# Altium schematic sheet 2_FPGA.schdoc.schdoc
size 431 x 309 mm; Symbol: Sheet-Symbol_A4; Device: Sheet-Symbol_A4; Company: 嘉立创EDA; Version: V1.0; Page Size: A4; @Project Name: ProDocument_LN_CTRL_V1; @Page Count: 5; @Update Date: 2026-01-05; @Create Date: 2026-01-05; @Schematic Name: Schematic1; @Page No: 2; @Page Name: FPGA
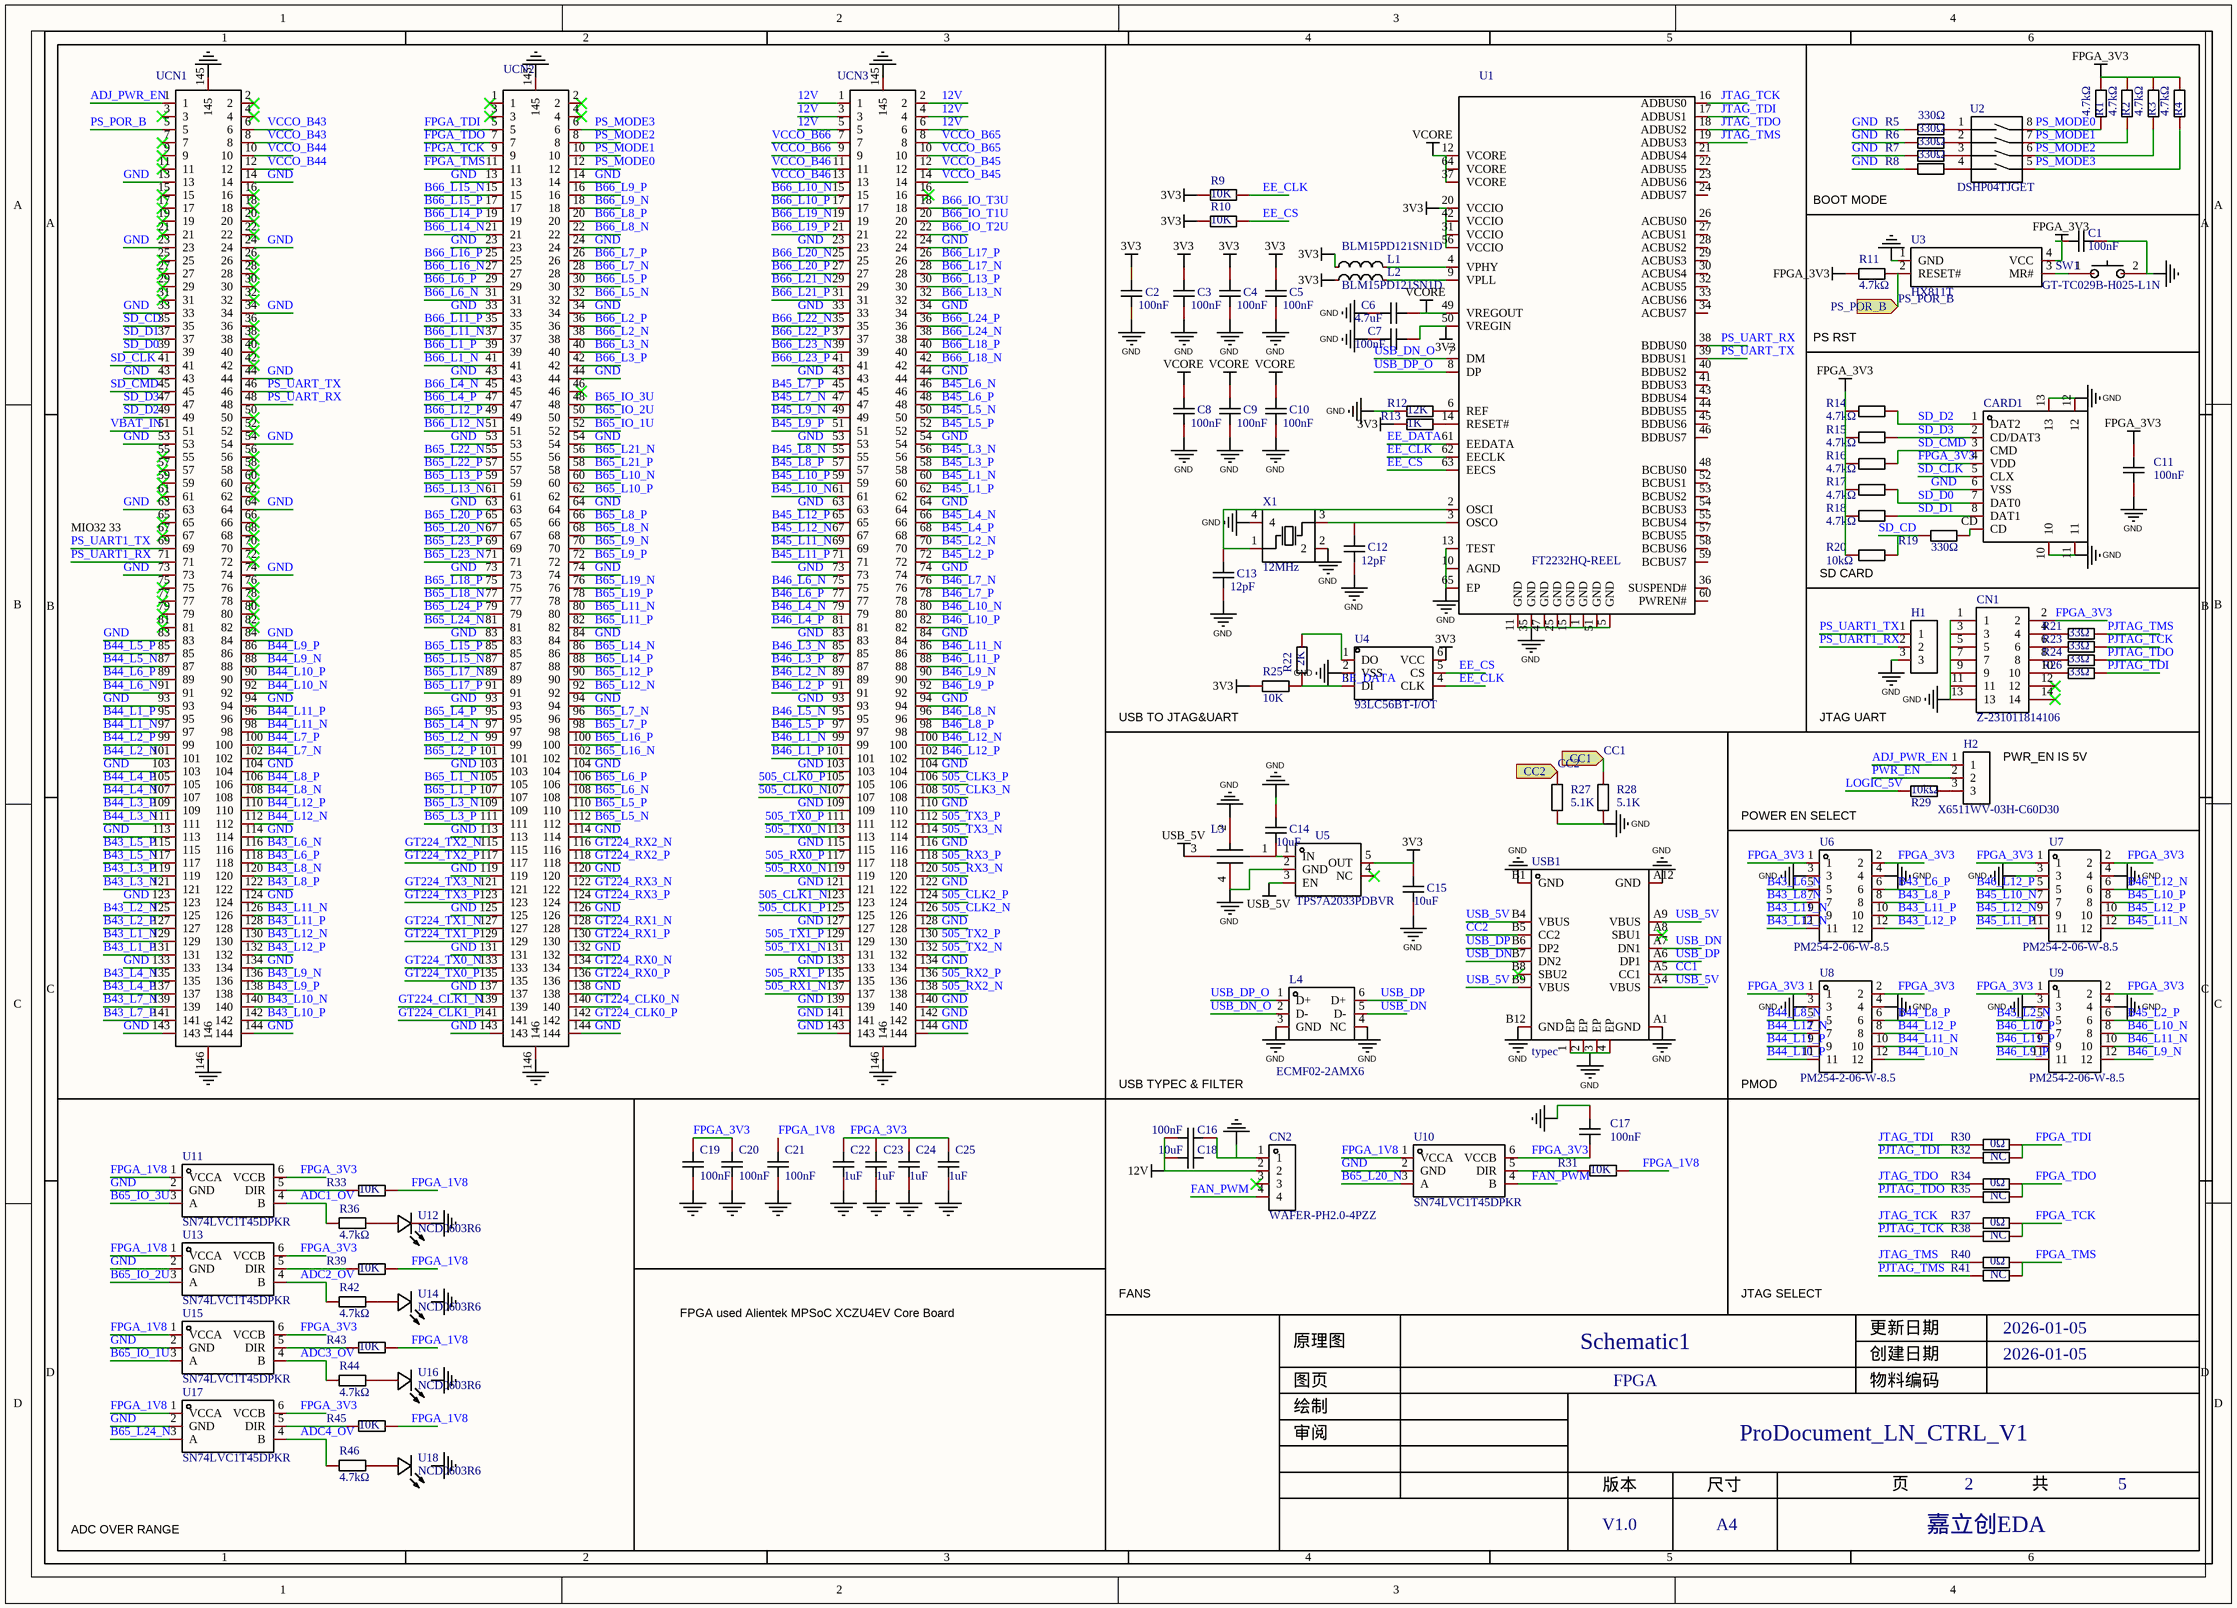
[diagram p0: 2_FPGA.schdoc.schdoc]

## Parts
C1  100nF  [C0402]
C2  100nF  [C0402]
C3  100nF  [C0402]
C4  100nF  [C0402]
C5  100nF  [C0402]
C6  4.7uF  [C0402]
C7  100nF  [C0402]
C8  100nF  [C0402]
C9  100nF  [C0402]
C10  100nF  [C0402]
C11  100nF  [C0402]
C12  12pF  [C0402]
C13  12pF  [C0402]
C14  10uF  [C0603]
C15  10uF  [C0603]
C16  100nF  [C0402]
C17  100nF  [C0402]
C18  10uF  [C0805]
C19  100nF  [C0402]
C20  100nF  [C0402]
C21  100nF  [C0402]
C22  1uF  [C0603]
C23  1uF  [C0603]
C24  1uF  [C0603]
C25  1uF  [C0603]
CARD1  TF PUSH  [TF-SMD_TF-PUSH]  (value not drawn)
CN1  Z-231011814106  [IDC-TH_14P-P2.54-V-R2-C7-S2.54]
CN2  WAFER-PH2.0-4PZZ  [CONN-TH_4P-P2.00_FWF20001-S04S22W5B]
H1  X6511WV-03H-C60D30  [HDR-TH_3P-P2.54-V-M]  (value not drawn)
H2  X6511WV-03H-C60D30  [HDR-TH_3P-P2.54-V-M]
L1  BLM15PD121SN1D  [L0402]
L2  BLM15PD121SN1D  [L0402]
L3  NFM21PC104R1E3D  [CAP-SMD_4P-L2.0-W1.25]  (value not drawn)
L4  ECMF02-2AMX6  [UFQFN-6_L1.7-W1.5]
R1  4.7kΩ  [R0402]
R2  4.7kΩ  [R0402]
R3  4.7kΩ  [R0402]
R4  4.7kΩ  [R0402]
R5  330Ω  [R0402]
R6  330Ω  [R0402]
R7  330Ω  [R0402]
R8  330Ω  [R0402]
R9  10K  [R0402]
R10  10K  [R0402]
R11  4.7kΩ  [R0402]
R12  12K  [R0402]
R13  1K  [R0402]
R14  4.7kΩ  [R0402]
R15  4.7kΩ  [R0402]
R16  4.7kΩ  [R0402]
R17  4.7kΩ  [R0402]
R18  4.7kΩ  [R0402]
R19  330Ω  [R0402]
R20  10kΩ  [R0402]
R21  33Ω  [R0402]
R22  2K  [R0402]
R23  33Ω  [R0402]
R24  33Ω  [R0402]
R25  10K  [R0402]
R26  33Ω  [R0402]
R27  5.1K  [R0402]
R28  5.1K  [R0402]
R29  10kΩ  [R0402]
R30  0Ω  [R0402]
R31  10K  [R0402]
R32  NC  [R0402]
R33  10K  [R0402]
R34  0Ω  [R0402]
R35  NC  [R0402]
R36  4.7kΩ  [R0402]
R37  0Ω  [R0402]
R38  NC  [R0402]
R39  10K  [R0402]
R40  0Ω  [R0402]
R41  NC  [R0402]
R42  4.7kΩ  [R0402]
R43  10K  [R0402]
R44  4.7kΩ  [R0402]
R45  10K  [R0402]
R46  4.7kΩ  [R0402]
SW1  GT-TC029B-H025-L1N  [SW-SMD_L3.9-W3.0-P4.45]
U1  FT2232HQ-REEL  [QFN-64_L9.0-W9.0-P0.50-TL-EP4.3]
U2  DSHP04TJGET  [SW-SMD_8P-L6.7-W5.4-P1.27-LS5.6]
U3  HX811T  [SOT-143_L2.9-W1.3-P1.92-LS2.3-BL]
U4  93LC56BT-I/OT  [SOT-23-6_L2.9-W1.6-P0.95-LS2.8-BR]
U5  TPS7A2033PDBVR  [SOT-23-5_L2.9-W1.6-P0.95-LS2.8-BR]
U6  PM254-2-06-W-8.5  [HDR-TH_12P-P2.54-H-F-R2-C6-W8.5]
U7  PM254-2-06-W-8.5  [HDR-TH_12P-P2.54-H-F-R2-C6-W8.5]
U8  PM254-2-06-W-8.5  [HDR-TH_12P-P2.54-H-F-R2-C6-W8.5]
U9  PM254-2-06-W-8.5  [HDR-TH_12P-P2.54-H-F-R2-C6-W8.5]
U10  SN74LVC1T45DPKR  [USON-6_L1.6-W1.6-P0.50-BL]
U11  SN74LVC1T45DPKR  [USON-6_L1.6-W1.6-P0.50-BL]
U12  NCD0603R6  [LED0603-RD]
U13  SN74LVC1T45DPKR  [USON-6_L1.6-W1.6-P0.50-BL]
U14  NCD0603R6  [LED0603-RD]
U15  SN74LVC1T45DPKR  [USON-6_L1.6-W1.6-P0.50-BL]
U16  NCD0603R6  [LED0603-RD]
U17  SN74LVC1T45DPKR  [USON-6_L1.6-W1.6-P0.50-BL]
U18  NCD0603R6  [LED0603-RD]
UCN1  FX10A-144S-SV  [FX10A-144S-SV]  (value not drawn)
UCN2  FX10A-144S-SV  [FX10A-144S-SV]  (value not drawn)
UCN3  FX10A-144S-SV  [FX10A-144S-SV]  (value not drawn)
USB1  typec  [USB-C-SMD_KH-TYPE-C-16P]
X1  12MHz  [OSC-SMD_4P-L2.5-W2.0-BL]

## Blocks framed on the sheet
MIO32 33: UCN1-UCN3
USB TO JTAG&UART: C2-C10 C12 C13 L1 L2 R9 R10 R12 R13 R22 R25 U1 U4 X1
BOOT MODE: R1-R8 U2
ADC OVER RANGE: R33 R36 R39 R42-R46 U11-U18

## Ports
CC1 (in), CC2 (in), PS_POR_B (in)

## Nets
3V3: C2.2 C3.2 C4.2 C5.2 C7.2 C15.2 L1.1 L2.1 R9.1 R10.1 R13.1 R25.2 U1.20(VCCIO) U1.31(VCCIO) U1.42(VCCIO) U1.50(VREGIN) U1.56(VCCIO) U4.6(VCC) U5.5(OUT)
12V: C16.2 C18.2 CN2.2 UCN3.1 UCN3.2 UCN3.3 UCN3.4 UCN3.5 UCN3.6
FPGA_3V3: C1.2 C11.1 C17.2 C19.2 C20.2 C22.2 C23.2 C24.2 C25.2 CARD1.4(VDD) CN1.2 R1.2 R2.2 R3.2 R4.2 R11.2 R14.2 R15.2 R16.2 R17.2 R18.2 R20.2 U3.4(VCC) U6.1 U6.2 U7.1 U7.2 U8.1 U8.2 U9.1 U9.2 U10.6(VCCB) U11.6(VCCB) U13.6(VCCB) U15.6(VCCB) U17.6(VCCB)
GND: C1.1 C2.1 C3.1 C4.1 C5.1 C6.2 C7.1 C8.1 C9.1 C10.1 C11.2 C12.1 C13.1 C14.2 C15.1 C16.1 C17.1 C19.1 C20.1 C21.1 C22.1 C23.1 C24.1 C25.1 CARD1.6(VSS) CARD1.10 CARD1.11 CARD1.12 CARD1.13 CN1.1 CN1.3 CN1.5 CN1.7 CN1.9 CN1.11 CN1.13 CN2.1 H1.3 L3.2(GND) L3.4(GND) L4.3(GND) L4.4(NC) R5.1 R6.1 R7.1 R8.1 R12.1 R27.1 R28.1 SW1.2 U1.1(GND) U1.5(GND) U1.10(AGND) U1.11(GND) U1.13(TEST) U1.15(GND) U1.25(GND) U1.35(GND) U1.47(GND) U1.51(GND) U1.65(EP) U3.1(GND) U4.2(VSS) U5.2(GND) U6.3 U6.4 U7.3 U7.4 U8.3 U8.4 U9.3 U9.4 U10.2(GND) U11.2(GND) U12.1(-) U13.2(GND) U15.2(GND) U17.2(GND) UCN1.13 UCN1.14 UCN1.23 UCN1.24 UCN1.33 UCN1.34 UCN1.43 UCN1.44 UCN1.53 UCN1.54 UCN1.63 UCN1.64 UCN1.73 UCN1.74 UCN1.83 UCN1.84 UCN1.93 UCN1.94 UCN1.103 UCN1.104 UCN1.113 UCN1.114 UCN1.123 UCN1.124 UCN1.133 UCN1.134 UCN1.143 UCN1.144 UCN1.145 UCN1.146 UCN2.13 UCN2.14 UCN2.23 UCN2.24 UCN2.33 UCN2.34 UCN2.43 UCN2.44 UCN2.53 UCN2.54 UCN2.63 UCN2.64 UCN2.73 UCN2.74 UCN2.83 UCN2.84 UCN2.93 UCN2.94 UCN2.103 UCN2.104 UCN2.113 UCN2.114 UCN2.119 UCN2.120 UCN2.125 UCN2.126 UCN2.131 UCN2.132 UCN2.137 UCN2.138 UCN2.143 UCN2.144 UCN2.145 UCN2.146 UCN3.23 UCN3.24 UCN3.33 UCN3.34 UCN3.43 UCN3.44 UCN3.53 UCN3.54 UCN3.63 UCN3.64 UCN3.73 UCN3.74 UCN3.83 UCN3.84 UCN3.93 UCN3.94 UCN3.103 UCN3.104 UCN3.109 UCN3.110 UCN3.115 UCN3.116 UCN3.121 UCN3.122 UCN3.127 UCN3.128 UCN3.133 UCN3.134 UCN3.139 UCN3.140 UCN3.141 UCN3.142 UCN3.143 UCN3.144 UCN3.145 UCN3.146 USB1.1(EP) USB1.2(EP) USB1.3(EP) USB1.4(EP) USB1.A1(GND) USB1.A12(GND) USB1.B1(GND) USB1.B12(GND) X1.2 X1.4
USB_5V: L3.3(OUT) U5.3(EN) USB1.A4(VBUS) USB1.A9(VBUS) USB1.B4(VBUS) USB1.B9(VBUS)
VCORE: C6.1 C8.2 C9.2 C10.2 U1.12(VCORE) U1.37(VCORE) U1.49(VREGOUT) U1.64(VCORE)
505_CLK0_N: UCN3.107
505_CLK0_P: UCN3.105
505_CLK1_N: UCN3.123
505_CLK1_P: UCN3.125
505_CLK2_N: UCN3.126
505_CLK2_P: UCN3.124
505_CLK3_N: UCN3.108
505_CLK3_P: UCN3.106
505_RX0_N: UCN3.119
505_RX0_P: UCN3.117
505_RX1_N: UCN3.137
505_RX1_P: UCN3.135
505_RX2_N: UCN3.138
505_RX2_P: UCN3.136
505_RX3_N: UCN3.120
505_RX3_P: UCN3.118
505_TX0_N: UCN3.113
505_TX0_P: UCN3.111
505_TX1_N: UCN3.131
505_TX1_P: UCN3.129
505_TX2_N: UCN3.132
505_TX2_P: UCN3.130
505_TX3_N: UCN3.114
505_TX3_P: UCN3.112
ADC1_OV: R36.2 U11.4(B)
ADC2_OV: R42.2 U13.4(B)
ADC3_OV: R44.2 U15.4(B)
ADC4_OV: R46.2 U17.4(B)
ADJ_PWR_EN: H2.1 UCN1.1
B43_L1_N: UCN1.129
B43_L1_P: UCN1.131
B43_L2_N: UCN1.125
B43_L2_P: UCN1.127
B43_L3_N: UCN1.121
B43_L3_P: UCN1.119
B43_L4_N: UCN1.135
B43_L4_P: UCN1.137
B43_L5_N: UCN1.117
B43_L5_P: UCN1.115
B43_L6_N: U6.5 UCN1.116
B43_L6_P: U6.6 UCN1.118
B43_L7_N: UCN1.139
B43_L7_P: UCN1.141
B43_L8_N: U6.7 UCN1.120
B43_L8_P: U6.8 UCN1.122
B43_L9_N: UCN1.136
B43_L9_P: UCN1.138
B43_L10_N: UCN1.140
B43_L10_P: UCN1.142
B43_L11_N: U6.9 UCN1.126
B43_L11_P: U6.10 UCN1.128
B43_L12_N: U6.11 UCN1.130
B43_L12_P: U6.12 UCN1.132
B44_L1_N: UCN1.97
B44_L1_P: UCN1.95
B44_L2_N: UCN1.101
B44_L2_P: UCN1.99
B44_L3_N: UCN1.111
B44_L3_P: UCN1.109
B44_L4_N: UCN1.107
B44_L4_P: UCN1.105
B44_L5_N: UCN1.87
B44_L5_P: UCN1.85
B44_L6_N: UCN1.91
B44_L6_P: UCN1.89
B44_L7_N: UCN1.102
B44_L7_P: UCN1.100
B44_L8_N: U8.5 UCN1.108
B44_L8_P: U8.6 UCN1.106
B44_L9_N: UCN1.88
B44_L9_P: UCN1.86
B44_L10_N: U8.12 UCN1.92
B44_L10_P: U8.11 UCN1.90
B44_L11_N: U8.10 UCN1.98
B44_L11_P: U8.9 UCN1.96
B44_L12_N: U8.7 UCN1.112
B44_L12_P: U8.8 UCN1.110
B45_L1_N: UCN3.60
B45_L1_P: UCN3.62
B45_L2_N: U9.5 UCN3.70
B45_L2_P: U9.6 UCN3.72
B45_L3_N: UCN3.56
B45_L3_P: UCN3.58
B45_L4_N: UCN3.66
B45_L4_P: UCN3.68
B45_L5_N: UCN3.50
B45_L5_P: UCN3.52
B45_L6_N: UCN3.46
B45_L6_P: UCN3.48
B45_L7_N: UCN3.47
B45_L7_P: UCN3.45
B45_L8_N: UCN3.55
B45_L8_P: UCN3.57
B45_L9_N: UCN3.49
B45_L9_P: UCN3.51
B45_L10_N: U7.7 UCN3.61
B45_L10_P: U7.8 UCN3.59
B45_L11_N: U7.12 UCN3.69
B45_L11_P: U7.11 UCN3.71
B45_L12_N: U7.9 UCN3.67
B45_L12_P: U7.10 UCN3.65
B46_L1_N: UCN3.99
B46_L1_P: UCN3.101
B46_L2_N: UCN3.89
B46_L2_P: UCN3.91
B46_L3_N: UCN3.85
B46_L3_P: UCN3.87
B46_L4_N: UCN3.79
B46_L4_P: UCN3.81
B46_L5_N: UCN3.95
B46_L5_P: UCN3.97
B46_L6_N: UCN3.75
B46_L6_P: UCN3.77
B46_L7_N: UCN3.76
B46_L7_P: UCN3.78
B46_L8_N: UCN3.96
B46_L8_P: UCN3.98
B46_L9_N: U9.12 UCN3.90
B46_L9_P: U9.11 UCN3.92
B46_L10_N: U9.8 UCN3.80
B46_L10_P: U9.7 UCN3.82
B46_L11_N: U9.10 UCN3.86
B46_L11_P: U9.9 UCN3.88
B46_L12_N: U7.6 UCN3.100
B46_L12_P: U7.5 UCN3.102
B65_IO_1U: U15.3(A) UCN2.52
B65_IO_2U: U13.3(A) UCN2.50
B65_IO_3U: U11.3(A) UCN2.48
B65_L1_N: UCN2.105
B65_L1_P: UCN2.107
B65_L2_N: UCN2.99
B65_L2_P: UCN2.101
B65_L3_N: UCN2.109
B65_L3_P: UCN2.111
B65_L4_N: UCN2.97
B65_L4_P: UCN2.95
B65_L5_N: UCN2.112
B65_L5_P: UCN2.110
B65_L6_N: UCN2.108
B65_L6_P: UCN2.106
B65_L7_N: UCN2.96
B65_L7_P: UCN2.98
B65_L8_N: UCN2.68
B65_L8_P: UCN2.66
B65_L9_N: UCN2.70
B65_L9_P: UCN2.72
B65_L10_N: UCN2.60
B65_L10_P: UCN2.62
B65_L11_N: UCN2.80
B65_L11_P: UCN2.82
B65_L12_N: UCN2.92
B65_L12_P: UCN2.90
B65_L13_N: UCN2.61
B65_L13_P: UCN2.59
B65_L14_N: UCN2.86
B65_L14_P: UCN2.88
B65_L15_N: UCN2.87
B65_L15_P: UCN2.85
B65_L16_N: UCN2.102
B65_L16_P: UCN2.100
B65_L17_N: UCN2.89
B65_L17_P: UCN2.91
B65_L18_N: UCN2.77
B65_L18_P: UCN2.75
B65_L19_N: UCN2.76
B65_L19_P: UCN2.78
B65_L20_N: U10.3(A) UCN2.67
B65_L20_P: UCN2.65
B65_L21_N: UCN2.56
B65_L21_P: UCN2.58
B65_L22_N: UCN2.55
B65_L22_P: UCN2.57
B65_L23_N: UCN2.71
B65_L23_P: UCN2.69
B65_L24_N: U17.3(A) UCN2.81
B65_L24_P: UCN2.79
B66_IO_T1U: UCN3.20
B66_IO_T2U: UCN3.22
B66_IO_T3U: UCN3.18
B66_L1_N: UCN2.41
B66_L1_P: UCN2.39
B66_L2_N: UCN2.38
B66_L2_P: UCN2.36
B66_L3_N: UCN2.40
B66_L3_P: UCN2.42
B66_L4_N: UCN2.45
B66_L4_P: UCN2.47
B66_L5_N: UCN2.32
B66_L5_P: UCN2.30
B66_L6_N: UCN2.31
B66_L6_P: UCN2.29
B66_L7_N: UCN2.28
B66_L7_P: UCN2.26
B66_L8_N: UCN2.22
B66_L8_P: UCN2.20
B66_L9_N: UCN2.18
B66_L9_P: UCN2.16
B66_L10_N: UCN3.15
B66_L10_P: UCN3.17
B66_L11_N: UCN2.37
B66_L11_P: UCN2.35
B66_L12_N: UCN2.51
B66_L12_P: UCN2.49
B66_L13_N: UCN3.32
B66_L13_P: UCN3.30
B66_L14_N: UCN2.21
B66_L14_P: UCN2.19
B66_L15_N: UCN2.15
B66_L15_P: UCN2.17
B66_L16_N: UCN2.27
B66_L16_P: UCN2.25
B66_L17_N: UCN3.28
B66_L17_P: UCN3.26
B66_L18_N: UCN3.42
B66_L18_P: UCN3.40
B66_L19_N: UCN3.19
B66_L19_P: UCN3.21
B66_L20_N: UCN3.25
B66_L20_P: UCN3.27
B66_L21_N: UCN3.29
B66_L21_P: UCN3.31
B66_L22_N: UCN3.35
B66_L22_P: UCN3.37
B66_L23_N: UCN3.39
B66_L23_P: UCN3.41
B66_L24_N: UCN3.38
B66_L24_P: UCN3.36
CC1: R28.2 USB1.A5(CC1) ; port CC1
CC2: R27.2 USB1.B5(CC2) ; port CC2
EE_CLK: R9.2 U1.62(EECLK) U4.4(CLK)
EE_CS: R10.2 U1.63(EECS) U4.5(CS)
EE_DATA: R22.1 R25.1 U1.61(EEDATA) U4.3(DI)
FAN_PWM: CN2.4 U10.4(B)
FPGA_1V8: C21.2 R31.1 R33.1 R39.1 R43.1 R45.1 U10.1(VCCA) U11.1(VCCA) U13.1(VCCA) U15.1(VCCA) U17.1(VCCA)
FPGA_TCK: R37.2 R38.2 UCN2.9
FPGA_TDI: R30.2 R32.2 UCN2.5
FPGA_TDO: R34.2 R35.2 UCN2.7
FPGA_TMS: R40.2 R41.2 UCN2.11
GT224_CLK0_N: UCN2.140
GT224_CLK0_P: UCN2.142
GT224_CLK1_N: UCN2.139
GT224_CLK1_P: UCN2.141
GT224_RX0_N: UCN2.134
GT224_RX0_P: UCN2.136
GT224_RX1_N: UCN2.128
GT224_RX1_P: UCN2.130
GT224_RX2_N: UCN2.116
GT224_RX2_P: UCN2.118
GT224_RX3_N: UCN2.122
GT224_RX3_P: UCN2.124
GT224_TX0_N: UCN2.133
GT224_TX0_P: UCN2.135
GT224_TX1_N: UCN2.127
GT224_TX1_P: UCN2.129
GT224_TX2_N: UCN2.115
GT224_TX2_P: UCN2.117
GT224_TX3_N: UCN2.121
GT224_TX3_P: UCN2.123
JTAG_TCK: R37.1 U1.16(ADBUS0)
JTAG_TDI: R30.1 U1.17(ADBUS1)
JTAG_TDO: R34.1 U1.18(ADBUS2)
JTAG_TMS: R40.1 U1.19(ADBUS3)
LOGIC_5V: R29.2
PJTAG_TCK: R23.2 R38.1
PJTAG_TDI: R26.2 R32.1
PJTAG_TDO: R24.2 R35.1
PJTAG_TMS: R21.2 R41.1
PS_MODE0: R1.1 U2.8 UCN2.12
PS_MODE1: R2.1 U2.7 UCN2.10
PS_MODE2: R3.1 U2.6 UCN2.8
PS_MODE3: R4.1 U2.5 UCN2.6
PS_POR_B: R11.1 U3.2(RESET#) UCN1.5 ; port PS_POR_B
PS_UART1_RX: H1.2 UCN1.71
PS_UART1_TX: H1.1 UCN1.69
PS_UART_RX: U1.38(BDBUS0) UCN1.48
PS_UART_TX: U1.39(BDBUS1) UCN1.46
PWR_EN: H2.2
SD_CD: R19.1 R20.1 UCN1.35
SD_CLK: CARD1.5(CLX) UCN1.41
SD_CMD: CARD1.3(CMD) R16.1 UCN1.45
SD_D0: CARD1.7(DAT0) R17.1 UCN1.39
SD_D1: CARD1.8(DAT1) R18.1 UCN1.37
SD_D2: CARD1.1(DAT2) R14.1 UCN1.49
SD_D3: CARD1.2(CD/DAT3) R15.1 UCN1.47
USB_DN: L4.5(D-) USB1.A7(DN1) USB1.B7(DN2)
USB_DN_O: L4.2(D-) U1.7(DM)
USB_DP: L4.6(D+) USB1.A6(DP1) USB1.B6(DP2)
USB_DP_O: L4.1(D+) U1.8(DP)
VBAT_IN: UCN1.51
VCCO_B43: UCN1.6 UCN1.8
VCCO_B44: UCN1.10 UCN1.12
VCCO_B45: UCN3.12 UCN3.14
VCCO_B46: UCN3.11 UCN3.13
VCCO_B65: UCN3.8 UCN3.10
VCCO_B66: UCN3.7 UCN3.9
NetC12_2: C12.2 U1.3(OSCO) X1.3(OSC2)
NetC13_2: C13.2 U1.2(OSCI) X1.1(OSC1)
NetC14_1: C14.1 L3.1(IN) U5.1(IN)
NetCARD1_CD: CARD1.CD R19.2
NetCN1_4: CN1.4 R21.1
NetCN1_6: CN1.6 R23.1
NetCN1_8: CN1.8 R24.1
NetCN1_10: CN1.10 R26.1
NetH2_3: H2.3 R29.1
NetL1_2: L1.2 U1.4(VPHY)
NetL2_2: L2.2 U1.9(VPLL)
NetR5_2: R5.2 U2.1
NetR6_2: R6.2 U2.2
NetR7_2: R7.2 U2.3
NetR8_2: R8.2 U2.4
NetR12_2: R12.2 U1.6(REF)
NetR13_2: R13.2 U1.14(RESET#)
NetR22_2: R22.2 U4.1(DO)
NetR31_2: R31.2 U10.5(DIR)
NetR33_2: R33.2 U11.5(DIR)
NetR36_1: R36.1 U12.2(+)
NetR39_2: R39.2 U13.5(DIR)
NetR42_1: R42.1 U14.2(+)
NetR43_2: R43.2 U15.5(DIR)
NetR44_1: R44.1 U16.2(+)
NetR45_2: R45.2 U17.5(DIR)
NetR46_1: R46.1 U18.2(+)
NetSW1_1: SW1.1 U3.3(MR#)

Not connected (* = marked no-connect by the designer): C18 1; CN1 12* 14*; CN2 3*; U1 21(ADBUS4) 22(ADBUS5) 23(ADBUS6) 24(ADBUS7) 26(ACBUS0) 27(ACBUS1) 28(ACBUS2) 29(ACBUS3) 30(ACBUS4) 32(ACBUS5) 33(ACBUS6) 34(ACBUS7) 36(SUSPEND#) 40(BDBUS2) 41(BDBUS3) 43(BDBUS4) 44(BDBUS5) 45(BDBUS6) 46(BDBUS7) 48(BCBUS0) 52(BCBUS1) 53(BCBUS2) 54(BCBUS3) 55(BCBUS4) 57(BCBUS5) 58(BCBUS6) 59(BCBUS7) 60(PWREN#); U5 4(NC)*; U14 1(-); U16 1(-); U18 1(-); UCN1 2* 3* 4* 7* 9* 11* 15* 16* 17* 18* 19* 20* 21* 22* 25* 26* 27* 28* 29* 30* 31* 32* 36* 38* 40* 42* 50* 52* 55* 56* 57* 58* 59* 60* 61* 62* 65* 66* 67* 68* 70* 72* 75* 76* 77* 78* 79* 80* 81* 82*; UCN2 1* 2* 3* 4* 46*; UCN3 16*; USB1 A8(SBU1)* B8(SBU2)*

## Notes on the sheet
- PS RST
- (near R20) SD CARD
- JTAG UART
- PWR_EN IS 5V
- (near U6) POWER EN SELECT
- USB TYPEC & FILTER
- PMOD
- FANS
- JTAG SELECT
- FPGA used Alientek MPSoC XCZU4EV Core Board
- 1
- 2
- 3
- 4
- 5
- 6
- A
- B
- C
- D
- 原理图
- Schematic1
- 创建日期
- 更新日期
- 2026-01-05
- 审阅
- 绘制
- 图页
- FPGA
- 物料编码
- ProDocument_LN_CTRL_V1
- 版本
- 尺寸
- 页
- 共
- V1.0
- A4
- 嘉立创EDA

## Library data of the parts
C1 C11 C16 C17 C19-C21 = GRM155R71H104KE14D: Manufacturer: muRata(村田); Add into BOM: yes; Tolerance: ±10%; Voltage Rated: 50V; Temperature Coefficient: X7R; Description: 容值:100nF;精度:±10%;额定电压:50V;材质(温度系数):X7R;; Name: 100nF; Symbol: GRM155R71H104KE14D; Device: GRM155R71H104KE14D; LCSC Part Name: 100nF ±10% 50V; Supplier Part: C77020; Manufacturer Part: GRM155R71H104KE14D; Supplier Footprint: 0402; JLCPCB Part Class: 扩展库; Datasheet: https://atta.szlcsc.com/upload/public/pdf/source/20180326/C77020_39BD49C951FF1AF0DB1F1FAC5AC1E401.pdf; Supplier: LCSC; Convert to PCB: yes; Value: 100nF
C2-C10 C12 C13 = CAP_0402: Symbol: CapAcitance; Convert to PCB: yes; Device: CAP_0402; Add into BOM: yes; Supplier Footprint: 0402
  C2-C5 C7-C10: Name: 100nF; Value: 100nF
  C6: Name: 4.7uF; Value: 4.7uF
  C12 C13: Name: 12pF; Value: 12pF
C14 C15 = GRM188Z71A106KA73D: Manufacturer: muRata(村田); Add into BOM: yes; Tolerance: ±10%; Voltage Rated: 10V; Temperature Coefficient: X7R; Description: 容值:10uF;精度:±10%;额定电压:10V;材质(温度系数):X7R;; Name: 10uF; Symbol: GRM188Z71A106KA73D; Device: GRM188Z71A106KA73D; LCSC Part Name: 10uF ±10% 10V; Supplier Part: C2959727; Manufacturer Part: GRM188Z71A106KA73D; Supplier Footprint: 0603; JLCPCB Part Class: 扩展库; Datasheet: https://atta.szlcsc.com/upload/public/pdf/source/20220328/6A4892B7E841253269A84FFE395E0578.pdf; Supplier: LCSC; Convert to PCB: yes; Value: 10uF
C18 = GRM21BR61H106KE43L: Manufacturer: muRata(村田); Add into BOM: yes; Tolerance: ±10%; Voltage Rated: 50V; Temperature Coefficient: X5R; Description: 容值:10uF;精度:±10%;额定电压:50V;材质(温度系数):X5R;; Name: 10uF; Symbol: GRM21BR61H106KE43L; Device: GRM21BR61H106KE43L; Supplier: LCSC; Supplier Part: C440198; Manufacturer Part: GRM21BR61H106KE43L; Value: 10uF; JLCPCB Part Class: 基础库; LCSC Part Name: 10uF ±10% 50V; Supplier Footprint: 0805; Datasheet: https://atta.szlcsc.com/upload/public/pdf/source/20230811/95AAE0C9AF55EDC31B7A4D8B733F534E.pdf; Convert to PCB: yes
C22-C25 = CC0603KRX7R9BB105: Manufacturer: YAGEO(国巨); Add into BOM: yes; Tolerance: ±10%; Voltage Rating: 50V; Temperature Coefficient: X7R; Description: 容值:1uF;精度:±10%;额定电压:50V;温度系数:X7R;; Name: 1uF; Symbol: CC0603KRX7R9BB105; Device: CC0603KRX7R9BB105; LCSC Part Name: 1uF ±10% 50V; Supplier Part: C559769; Manufacturer Part: CC0603KRX7R9BB105; Supplier Footprint: 0603; JLCPCB Part Class: 扩展库; Datasheet: https://item.szlcsc.com/datasheet/CC0603KRX7R9BB105/584032.html; Supplier: LCSC; Convert to PCB: yes; Value: 1uF
CARD1 = TF PUSH: Manufacturer: SHOU HAN(首韩); Add into BOM: yes; Card Connection Mode: 自弹式; Card Type: MicroSD卡(TF卡); Connector Type: 卡座; Maximum Body Height: 2mm; Description: 卡连接方式:自弹式;卡类型:MicroSD卡(TF卡);连接器类型:卡座;本体最大高度:2mm;工作温度范围:-20℃~+90℃;; Name: TF PUSH; Symbol: TF PUSH; Device: TF PUSH; Supplier: LCSC; Supplier Part: C393941; Manufacturer Part: TF PUSH; JLCPCB Part Class: 扩展库; LCSC Part Name: 自弹式 MicroSD卡(TF卡) 卡座; Supplier Footprint: SMD; Datasheet: https://atta.szlcsc.com/upload/public/pdf/source/20191011/C393941_0DDD896EE907FEB750D8B7B8982E2A67.pdf; Convert to PCB: yes; Operating Temperature Range: -20℃~+90℃
CN1 = Z-231011814106: Manufacturer: Nextron(正凌); Add into BOM: yes; Connector Type: 简牛座; Pitch: 2.54mm; Number of Positions or Pins: 2x7P; Holder Type: 直插; Number of PINs Per Row: 7; Description: 连接器类型:简牛座;间距:2.54mm;结构:2x7P;安装方式:直插;行距:2.54mm;排数:2;每排PIN数:7;触头材质:黄铜;触头镀层:金;; Name: Z-231011814106; Symbol: Z-231011814106; Device: Z-231011814106; LCSC Part Name: 2.54mm 2x7P 排数:2 每排P数:7; Supplier Part: C93702; Manufacturer Part: Z-231011814106; Supplier Footprint: 插件,P=2.54mm; JLCPCB Part Class: 扩展库; Datasheet: https://item.szlcsc.com/datasheet/Z-231011814106/94900.html; Supplier: LCSC; Convert to PCB: yes; Row Spacing: 2.54mm; Number of Rows: 2; Contact Material: 黄铜; Contact Plating: 金
CN2 = WAFER-PH2.0-4PZZ: Manufacturer: XUNPU(讯普); Add into BOM: yes; Pins Structure: 1x4P; Pitch: 2mm; Reference Series: PH; Number of PINs Per Row: 4; Current Rating: 2A; Voltage Rating: 250V; Plastic Material: PA66; Flame Retardant Rating: UL94V-0; Z-Height of the Board: 6.05mm; X-Length of Bottom Edge on Board (Spacing Line): 10mm; Y-Width of Bottom Edge on Board: 4.7mm; Description: 插针结构:1x4P;间距:2mm;安装方式:直插;参考系列:PH;总PIN数:4P;排数:1;每排PIN数:4;行距:-;额定电流:2A;触头材质:黄铜;触头镀层:锡;工作温度:-25℃~+85℃;; Name: WAFER-PH2.0-4PZZ; Symbol: WAFER-PH2.0-4PZZ; Device: WAFER-PH2.0-4PZZ; LCSC Part Name: 1x4P 间距:2mm 直插 系列:PH; Supplier Part: C5359601; Manufacturer Part: WAFER-PH2.0-4PZZ; Supplier Footprint: 插件,P=2mm; JLCPCB Part Class: 扩展库; Datasheet: https://item.szlcsc.com/datasheet/WAFER-PH2.0-4PZZ/6173837.html; Supplier: LCSC; Convert to PCB: yes; Mounting Type: 直插; Number of Pins: 4P; Number of Rows: 1; Row Spacing: -; Contact Material: 黄铜; Contact Plating: 锡; Operating Temperature: -25℃~+85℃; Supplementary Features: -; Color: 白色
H1 H2 = X6511WV-03H-C60D30: Manufacturer: XKB Connection(中国星坤); Symbol: X6511WV-03H-C30D60; Add into BOM: yes; Pin Structure: 1x3P; Pitch: 2.54mm; Circluar Pins/Square Pins: 方针; Current Rating: 3A; Voltage Rating (Max): 250V; Description: 插针结构:1x3P;间距:2.54mm;行距:-;圆针/方针:方针;排数:单排;总PIN位数:3P;额定电流:3A;额定电压:250V;配合针长度:-;塑高:2.5mm;端接针长度:-;触头材质:黄铜;触头镀层:金;工作温度:-40℃~+105℃;颜色:黑色;; Name: X6511WV-03H-C60D30; Device: X6511WV-03H-C60D30; LCSC Part Name: 1x3P 间距:2.54mm 方针; Supplier Part: C706875; Manufacturer Part: X6511WV-03H-C60D30; Supplier Footprint: 插件,P=2.54mm; JLCPCB Part Class: 扩展库; Datasheet: https://item.szlcsc.com/datasheet/X6511WV-03H-C60D30/743997.html; Supplier: LCSC; Convert to PCB: yes; Row Spacing: -; Number of Rows: 单排; Number of Pins: 3P; Length of Mating Pin: -; Insulation Height: 2.5mm; Length of End Connection Pin: -; Contact Material: 黄铜; Contact Plating: 金; Operating Temperature: -40℃~+105℃; Color: 黑色
L1 L2 = BLM15PD121SN1D: Manufacturer: muRata(村田); Add into BOM: yes; Impedance @ Frequency: 120Ω@100MHz; Tolerance: ±25%; DC Resistance: 90mΩ; Current Rating: 1.3A; Circuits: 1; Description: 标称阻抗@测试频率:120Ω@100MHz;误差:±25%;直流电阻(RDC):90mΩ;; Name: BLM15PD121SN1D; Symbol: BLM15PD121SN1D; Device: BLM15PD121SN1D; LCSC Part Name: 单路 0402磁珠 阻抗120Ω@100MHz; Supplier Part: C76891; Manufacturer Part: BLM15PD121SN1D; Supplier Footprint: 0402; Datasheet: https://atta.szlcsc.com/upload/public/pdf/source/20180326/C76891_C89C2C1119D9992B67A2515C9BBB882D.pdf; Supplier: LCSC; Convert to PCB: yes
L3 = NFM21PC104R1E3D: Manufacturer: muRata(村田); Add into BOM: yes; Nominal Capacitance: 100nF; CapacitanceTolerance: ±20%; DC Rated Voltage: 25V; Rated Current: 2A; DC Resistance: 30mΩ; Description: 电容量:100nF;精度:±20%;直流电阻:30mΩ;; Name: NFM21PC104R1E3D; Symbol: NFM21PC104R1E3D; Device: NFM21PC104R1E3D; LCSC Part Name: 100nF(104) ±20% 25V; Supplier Part: C86150; Manufacturer Part: NFM21PC104R1E3D; Supplier Footprint: 0805; JLCPCB Part Class: 扩展库; Datasheet: https://atta.szlcsc.com/upload/public/pdf/source/20180326/C86150_E4B7366323682FA84DED9003C68CA797.pdf; Supplier: LCSC; Convert to PCB: yes; Operating Temperature: -55℃~+125℃
L4 = ECMF02-2AMX6: Manufacturer: ST(意法半导体); Add into BOM: yes; Number of Lines: 2; Current Rating: 200mA; DC Resistance (DCR): 2.5Ω; Description: 线路数:2;直流电阻(DCR):2.5Ω;; Name: ECMF02-2AMX6; Symbol: ECMF02-2AMX6; Device: ECMF02-2AMX6; LCSC Part Name: ECMF02-2AMX6; Supplier Part: C2651144; Manufacturer Part: ECMF02-2AMX6; Supplier Footprint: UFQFN-6(1.5x1.7); JLCPCB Part Class: 扩展库; Datasheet: https://atta.szlcsc.com/upload/public/pdf/source/20210702/5ABAEB64ABBB5666ADAF5B85EB7C19E4.pdf; Supplier: LCSC; Convert to PCB: yes; Operating Temperature: -40℃~+85℃
R1-R4 R11 R14-R18 R20 R29 R36 R42 R44 R46 = 0402WGF4701TCE: Manufacturer: UNI-ROYAL(厚声); Add into BOM: yes; Tolerance: ±1%; Power(Watts): 62.5mW; Voltage-Supply(Max): 50V; Temperature Coefficient: ±100ppm/℃; Description: 电阻类型:厚膜电阻;阻值:4.7kΩ;精度:±1%;功率:62.5mW;工作电压:50V;温度系数:±100ppm/℃;; Symbol: 0402WGF4701TCE; Device: 0402WGF4701TCE; LCSC Part Name: 4.7kΩ ±1% 62.5mW 厚膜电阻; Supplier Part: C25900; Manufacturer Part: 0402WGF4701TCE; Supplier Footprint: 0402; JLCPCB Part Class: 基础库; Datasheet: https://item.szlcsc.com/datasheet/0402WGF4701TCE/26643.html; Supplier: LCSC; Convert to PCB: yes; Type: 厚膜电阻; Operating Temperature: -55℃~+155℃
  R1-R4 R11 R14-R18 R36 R42 R44 R46: Name: 4.7kΩ; Value: 4.7kΩ
  R20 R29: Name: 10kΩ; Value: 10kΩ
R5-R8 R19 = 0402WGF3300TCE: Manufacturer: UNI-ROYAL(厚声); Add into BOM: yes; Tolerance: ±1%; Power(Watts): 62.5mW; Voltage-Supply(Max): 50V; Temperature Coefficient: ±100ppm/℃; Description: 电阻类型:厚膜电阻;阻值:330Ω;精度:±1%;功率:62.5mW;工作电压:50V;温度系数:±100ppm/℃;; Name: 330Ω; Symbol: 0402WGF3300TCE; Device: 0402WGF3300TCE; LCSC Part Name: 330Ω ±1% 62.5mW 厚膜电阻; Supplier Part: C25104; Manufacturer Part: 0402WGF3300TCE; Supplier Footprint: 0402; JLCPCB Part Class: 基础库; Datasheet: https://item.szlcsc.com/datasheet/0402WGF3300TCE/25847.html; Supplier: LCSC; Convert to PCB: yes; Type: 厚膜电阻; Value: 330Ω; Operating Temperature: -55℃~+155℃
R9 R10 R12 R13 R22 R25 R27 R28 R31 R33 R39 R43 R45 = Res_0402: Symbol: 电阻; Convert to PCB: yes; Device: Res_0402; Add into BOM: yes; Supplier Footprint: 0402
  R9 R10 R25 R31 R33 R39 R43 R45: Name: 10K; Value: 10K
  R12: Name: 12K; Value: 12K
  R13: Name: 1K; Value: 1K
  R22: Name: 2K; Value: 2K
  R27 R28: Name: 5.1K; Value: 5.1K
R21 R23 R24 R26 = 0402WGF330JTCE: Manufacturer: UNI-ROYAL(厚声); Add into BOM: yes; Tolerance: ±1%; Power(Watts): 62.5mW; Voltage-Supply(Max): 50V; Temperature Coefficient: ±100ppm/℃; Description: 电阻类型:厚膜电阻;阻值:33Ω;精度:±1%;功率:62.5mW;工作电压:50V;温度系数:±100ppm/℃;; Name: 33Ω; Symbol: 0402WGF330JTCE; Device: 0402WGF330JTCE; LCSC Part Name: 33Ω ±1% 62.5mW 厚膜电阻; Supplier Part: C25105; Manufacturer Part: 0402WGF330JTCE; Supplier Footprint: 0402; JLCPCB Part Class: 基础库; Datasheet: https://item.szlcsc.com/datasheet/0402WGF330JTCE/25848.html; Supplier: LCSC; Convert to PCB: yes; Type: 厚膜电阻; Value: 33Ω; Operating Temperature: -55℃~+155℃
R30 R32 R34 R35 R37 R38 R40 R41 = 0402WGF0000TCE: Manufacturer: UNI-ROYAL(厚声); Add into BOM: yes; Tolerance: ±1%; Power(Watts): 62.5mW; Voltage-Supply(Max): 50V; Temperature Coefficient: ±800ppm/℃; Description: 电阻类型:厚膜电阻;阻值:0Ω;精度:±1%;功率:62.5mW;工作电压:50V;温度系数:±800ppm/℃;; Symbol: 0402WGF0000TCE; Device: 0402WGF0000TCE; LCSC Part Name: 0Ω ±1% 62.5mW 厚膜电阻; Supplier Part: C17168; Manufacturer Part: 0402WGF0000TCE; Supplier Footprint: 0402; JLCPCB Part Class: 基础库; Datasheet: https://item.szlcsc.com/datasheet/0402WGF0000TCE/17853.html; Supplier: LCSC; Convert to PCB: yes; Type: 厚膜电阻; Operating Temperature: -55℃~+155℃
  R30 R34 R37 R40: Name: 0Ω; Value: 0Ω
  R32 R35 R38 R41: Name: NC; Value: NC
SW1 = GT-TC029B-H025-L1N: Manufacturer: G-Switch(品赞); Add into BOM: yes; Circuit: 单刀单掷; Actuator Style: 圆形按钮; Operating Force: 2.5N; Switch Length: 3.9mm; Switch Width: 2.9mm; Switch Height: 2.5mm; Strike Gundam: 不带; Contact Current: 50mA; Voltage Rating (DC): 12V; Insulation Resistance: 100MΩ; Actuator/Cap Color: 黑色; With Lamp: 无; Pin Style: SMD接片; Mechanical Life: 10万次; Description: 电路结构:单刀单掷;按钮形状:圆形按钮;作用力:2.5N;安装方式:立贴;开关长度:3.9mm;开关宽度:2.9mm;开关高度:2.5mm;带支架:不带;触点电流:50mA;额定电压(DC):12V;绝缘电阻:100MΩ;带灯:无;机械寿命:10万次;; Name: GT-TC029B-H025-L1N; Symbol: GT-TC029B-H025-L1N; Device: GT-TC029B-H025-L1N; LCSC Part Name: 3.9*2.9*2.5mm 立贴 轻触开关; Supplier Part: C843669; Manufacturer Part: GT-TC029B-H025-L1N; Supplier Footprint: SMD; JLCPCB Part Class: 扩展库; Datasheet: https://atta.szlcsc.com/upload/public/pdf/source/20231124/9839E728E86EAB127AE2541ED475D299.pdf; Supplier: LCSC; Convert to PCB: yes; Mounting Style: 立贴; Operating Temperature: -30℃~+85℃
U1 = FT2232HQ-REEL: 应用功能:USB转UART；USB转FIFO;接口协议:UART;供电电压:3V~3.6V;; Manufacturer: FTDI(飞特帝亚); Add into BOM: yes; Protocol: UART; Name: FT2232HQ-REEL; Symbol: FT2232HQ-REEL; Device: FT2232HQ-REEL; LCSC Part Name: FT2232HQ-REEL; Supplier Part: C193662; Manufacturer Part: FT2232HQ-REEL; Supplier Footprint: QFN-64-EP(9x9); JLCPCB Part Class: 扩展库; Datasheet: https://atta.szlcsc.com/upload/public/pdf/source/20180530/C193662_F14B45A4B5271BE746E436B0F2E041EE.pdf; Supplier: LCSC; Convert to PCB: yes; Applications Function: USB转UART；USB转FIFO; Supply Voltage: 3V~3.6V; Operating Temperature: -40℃~+85℃
U2 = DSHP04TJGET: Manufacturer: KE(广督); Add into BOM: yes; Circuit: 单刀单掷; Number of Positions: 4位; Current Rating: 25mA; Voltage Rating: 24V; Operating Life: 3千次; Description: 类型:平拨,凹槽式;电路结构:单刀单掷;开关位数:4位;额定电流:25mA;额定电压:24V;工作寿命:3千次;颜色:黑色;; Name: DSHP04TJGET; Symbol: DSHP04TJGET; Device: DSHP04TJGET; LCSC Part Name: 1.27mm 4位贴片拨码开关(J脚); Supplier Part: C5144955; Manufacturer Part: DSHP04TJGET; Supplier Footprint: SMD-8P,5.4x6.6mm; JLCPCB Part Class: 扩展库; Datasheet: https://item.szlcsc.com/datasheet/DSHP04TJGET/5767028.html; Supplier: LCSC; Convert to PCB: yes; Type: 平拨,凹槽式; Termination Style: J型引脚; Lead Pitch: 1.27mm; Operating Temperature: -40℃~+85℃; Color: 黑色
U3 = HX811T: Manufacturer: HX(恒佳兴); Add into BOM: yes; ChipType: 电压监控器; Voltage - Supply: 1V~6V; Reset Active Level: 低电平有效; Threshold Voltage: 3.08V; Number of Voltages Monitored: 1; Manual Reset: 有; Watchdog: 无; Reset Timeout: 500ms; Description: 工作电压:1V~6V;复位有效电平:低电平有效;受监控电压数:1;复位超时:500ms;; Name: HX811T; Symbol: HX811T; Device: HX811T; LCSC Part Name: 检测复位IC  HX811T; Supplier Part: C296128; Manufacturer Part: HX811T; Supplier Footprint: SOT-143; JLCPCB Part Class: 扩展库; Datasheet: https://item.szlcsc.com/datasheet/HX811T/280548.html; Supplier: LCSC; Convert to PCB: yes; Operating Temperature: -20℃~+70℃@(Ta)
U4 = 93LC56BT-I/OT: Manufacturer: MICROCHIP(美国微芯); Add into BOM: yes; Description: The Microchip 93LC56B device is a 2Kb Microwire (3-wire) Serial EEPROM with dedicated 16-bit memory organization and a voltage operation range of 2.5 - 5.5V.? Also available are the 93LC56A for dedicated 8-bit memory organization and the 93LC56C for hardw; Name: 93LC56BT-I/OT; Symbol: 93LC56BT-I/OT; Device: 93LC56BT-I/OT; LCSC Part Name: 93LC56BT-I/OT; Supplier Part: C190271; Manufacturer Part: 93LC56BT-I/OT; Supplier Footprint: SOT-23-6; Datasheet: https://atta.szlcsc.com/upload/public/pdf/source/20180423/C190271_ABAD329DACFE2165969EA1B02E3F54C8.pdf; Supplier: LCSC; Convert to PCB: yes
U5 = TPS7A2033PDBVR: Manufacturer: TI(德州仪器); Add into BOM: yes; Name: TPS7A2033PDBVR; Symbol: TPS7A2033PDBVR; Device: TPS7A2033PDBVR; LCSC Part Name: TPS7A2033PDBVR; Supplier Part: C2862740; Manufacturer Part: TPS7A2033PDBVR; Supplier Footprint: SOT-23-5; JLCPCB Part Class: 扩展库; Datasheet: https://atta.szlcsc.com/upload/public/pdf/source/20230221/9B73099824E408F4B24BD95C528A27ED.pdf; Supplier: LCSC; Convert to PCB: yes
U6-U9 = PM254-2-06-W-8.5: Manufacturer: HCTL(华灿天禄); Add into BOM: yes; Holes Structure: 2x6P; Pitch: 2.54mm; Circular Hole / Square Hole: 方孔; Number of Holes: 12P; Current Rating (Max): 3A; Holes Direction: 侧面; Description: 插孔结构:2x6P;间距:2.54mm;行距:2.54mm;圆孔/方孔:方孔;安装类型:弯插;排数:双排;总孔位数:12P;额定电流:3A;额定电压:-;插孔方向:侧面;塑高:8.5mm;工作温度范围:-40℃~+105℃;; Name: PM254-2-06-W-8.5; Symbol: PM254-2-06-W-8.5; Device: PM254-2-06-W-8.5; Supplier: LCSC; Supplier Part: C2897426; Manufacturer Part: PM254-2-06-W-8.5; JLCPCB Part Class: 扩展库; LCSC Part Name: 间距:2.54mm 2x6P 弯插; Supplier Footprint: 弯插,P=2.54mm; Datasheet: https://atta.szlcsc.com/upload/public/pdf/source/20230609/283C0D22EF4E6FFE03D5A855876981ED.pdf; Convert to PCB: yes; Row Spacing: 2.54mm; Mounting Type: 弯插; Number of Rows: 双排; Voltage Rating (Max): -; Insulation Height: 8.5mm; Operating Temperature Range: -40℃~+105℃
U10 U11 U13 U15 U17 = SN74LVC1T45DPKR: Manufacturer: TI(德州仪器); Add into BOM: yes; Channel Type: 双向; Data Rate: 420Mbps; Voltage - Supply(VCCA): 1.65V~5.5V; Number of Circuits: 1; Output Type: 三态; Description: 数据速率:420Mbps;工作电压(VCCA):1.65V~5.5V;工作电压(VCCB):1.65V~5.5V;通道数:1;每个电路通道数:1;; Name: SN74LVC1T45DPKR; Symbol: SN74LVC1T45DPKR; Device: SN74LVC1T45DPKR; LCSC Part Name: 420Mbps 1位双向电平转换器; Supplier Part: C2677455; Manufacturer Part: SN74LVC1T45DPKR; Supplier Footprint: USON-6(1.6x1.6); JLCPCB Part Class: 扩展库; Datasheet: https://www.ti.com/cn/lit/gpn/sn74lvc1t45; Supplier: LCSC; Convert to PCB: yes; Input Signal: -; Output Signal: -; Voltage - Supply(VCCB): 1.65V~5.5V; Operating Temperature: -40℃~+85℃; Features: -
U12 U14 U16 U18 = NCD0603R6: Manufacturer: 国星光电; Add into BOM: yes; Emitted Color: 红色; Forward Voltage (VF): 1.6V~2.4V; Power Dissipation: 65mW; Forward Current: 25mA; Dominant Wavelength: 620nm~630nm; Peak Wavelength: 630nm; Lens Color: 无色透明透镜; Luminous Intensity: 30mcd~80mcd; Viewing Angle: 140°; Description: 发光颜色:红色;正向电压(VF):1.6V~2.4V;功率:65mW;正向电流:25mA;主波长:620nm~630nm;透镜颜色:无色透明透镜;发光强度:30mcd~80mcd;发光角度:140°;工作温度:-30℃~+85℃;; Name: NCD0603R6; Symbol: NCD0603R6; Device: NCD0603R6; LCSC Part Name: NCD0603R6; Supplier Part: C7429910; Manufacturer Part: NCD0603R6; Supplier Footprint: 0603; JLCPCB Part Class: 扩展库; Datasheet: https://atta.szlcsc.com/upload/public/pdf/source/20230620/13EAC00507632A35BC4A697CF03A06D7.pdf; Supplier: LCSC; Convert to PCB: yes; Operating Temperature: -30℃~+85℃
UCN1-UCN3 = FX10A-144S-SV: Add into BOM: yes; Symbol: FX10A-144S-SV; Device: FX10A-144S-SV; Convert to PCB: yes
USB1 = typec: Symbol: TYPEC_C9900016956; Add into BOM: yes; Name: typec; Device: typec; LCSC Part Name: typec; Supplier Part: C9900016956; Manufacturer Part: typec; Supplier Footprint: typec 12p; JLCPCB Part Class: 扩展库; Supplier: LCSC; Convert to PCB: yes
X1 = TXM12M0004252FBCEO00T: Manufacturer: YJX(雅晶鑫); Add into BOM: yes; Crystal Type: 贴片无源晶振; Load Capacitance: 12pF; Equivalent Series Resistance (ESR): 120Ω; Frequency Tolerance: ±10ppm; Frequency Stability: ±30ppm; Description: 频率:12MHz;负载电容:12pF;频率公差:±10ppm;; Name: 12MHz; Symbol: TXM12M0004252FBCEO00T; Device: TXM12M0004252FBCEO00T; Supplier: LCSC; Supplier Part: C284155; Manufacturer Part: TXM12M0004252FBCEO00T; Value: 12MHz; LCSC Part Name: 12MHz ±10ppm 12pF; Supplier Footprint: SMD2520-4P; Datasheet: https://atta.szlcsc.com/upload/public/pdf/source/20180910/C284155_B9AC3CB548367C19CE747B551130DB15.pdf; Convert to PCB: yes; Operating Temperature: -40℃~+85℃